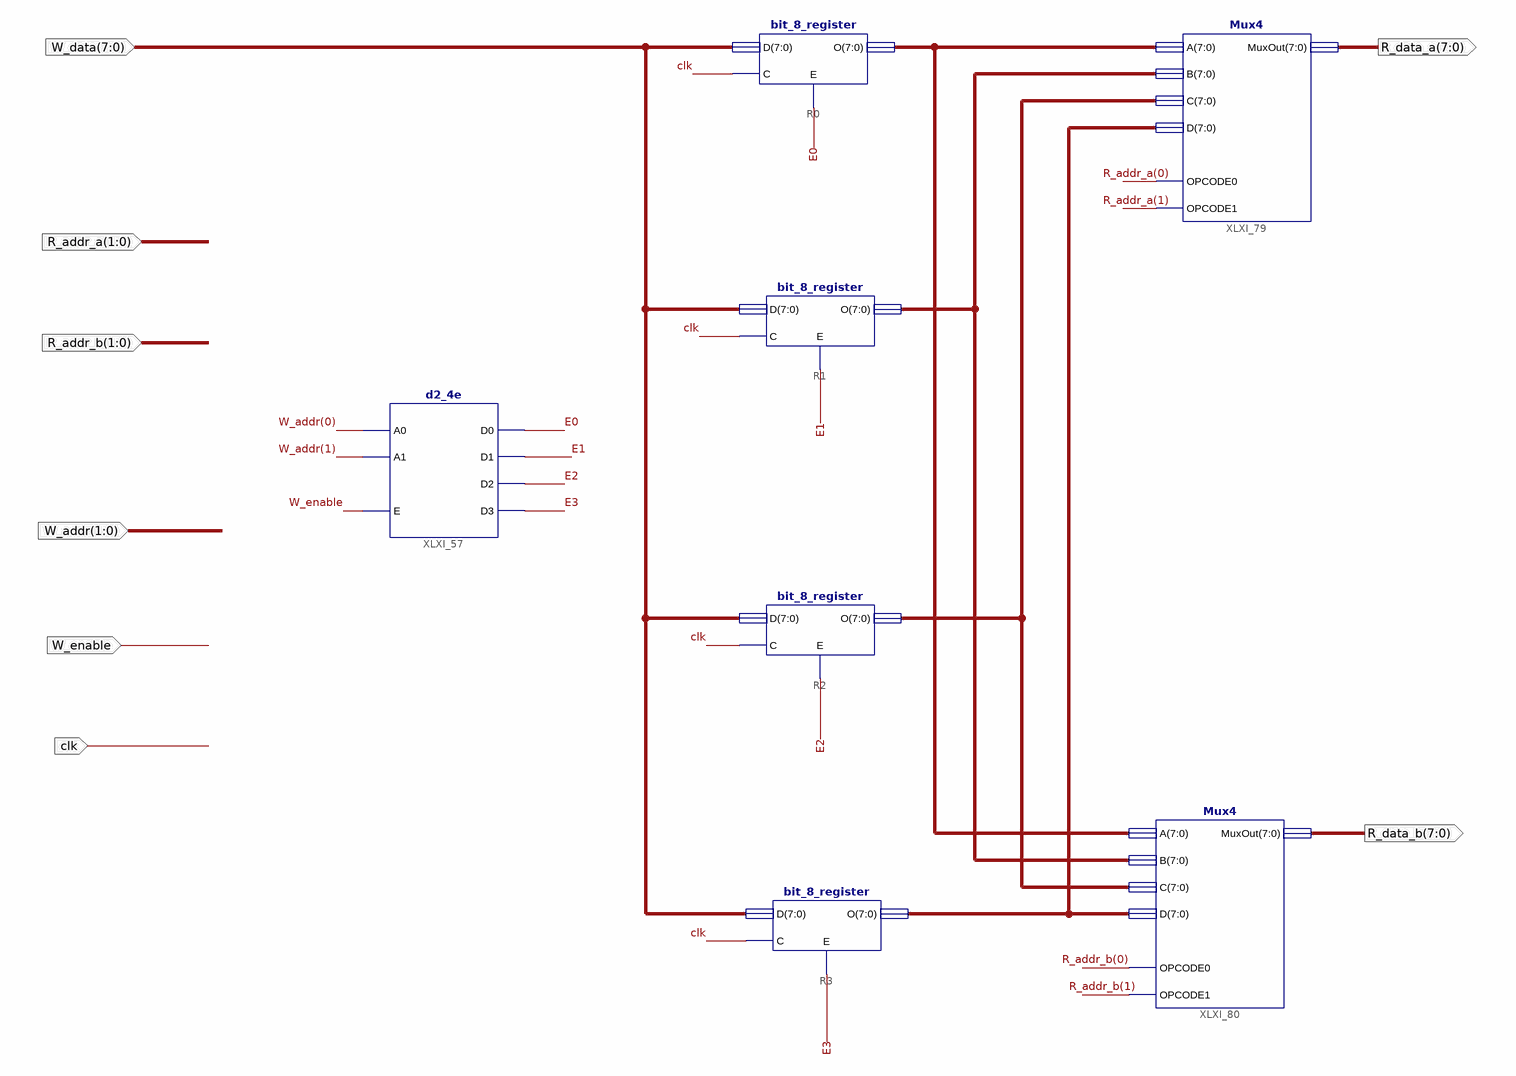
[diagram p0: schematic sheet 1]
// Xilinx ISE schematic RegFile.sch (spartan6) as structural Verilog: 7 symbols, 8 ports
module RegFile (
  input  [1:0] R_addr_a,
  input  [1:0] R_addr_b,
  input  [1:0] W_addr,
  input  clk,
  input  [7:0] W_data,
  input  W_enable,
  output [7:0] R_data_a,
  output [7:0] R_data_b
);

  wire E0, E1, E2, E3;
  wire [7:0] XLXN_89, XLXN_90, XLXN_92, XLXN_94;

  bit_8_register R2 (.D(W_data), .C(clk), .E(E2), .O(XLXN_90));
  bit_8_register R1 (.D(W_data), .C(clk), .E(E1), .O(XLXN_94));
  bit_8_register R0 (.D(W_data), .C(clk), .E(E0), .O(XLXN_92));
  bit_8_register R3 (.D(W_data), .C(clk), .E(E3), .O(XLXN_89));
  d2_4e XLXI_57 (.A0(W_addr[0]), .A1(W_addr[1]), .E(W_enable), .D0(E0), .D1(E1), .D2(E2), .D3(E3));
  Mux4 XLXI_79 (
    .OPCODE0(R_addr_a[0]), .OPCODE1(R_addr_a[1]), .B(XLXN_94), .A(XLXN_92), .C(XLXN_90), .D(XLXN_89),
    .MuxOut(R_data_a));
  Mux4 XLXI_80 (
    .OPCODE0(R_addr_b[0]), .OPCODE1(R_addr_b[1]), .B(XLXN_94), .A(XLXN_92), .C(XLXN_90), .D(XLXN_89),
    .MuxOut(R_data_b));
endmodule
